# EAGLE design TC4nano_v2 (EAGLE 9.2.1)
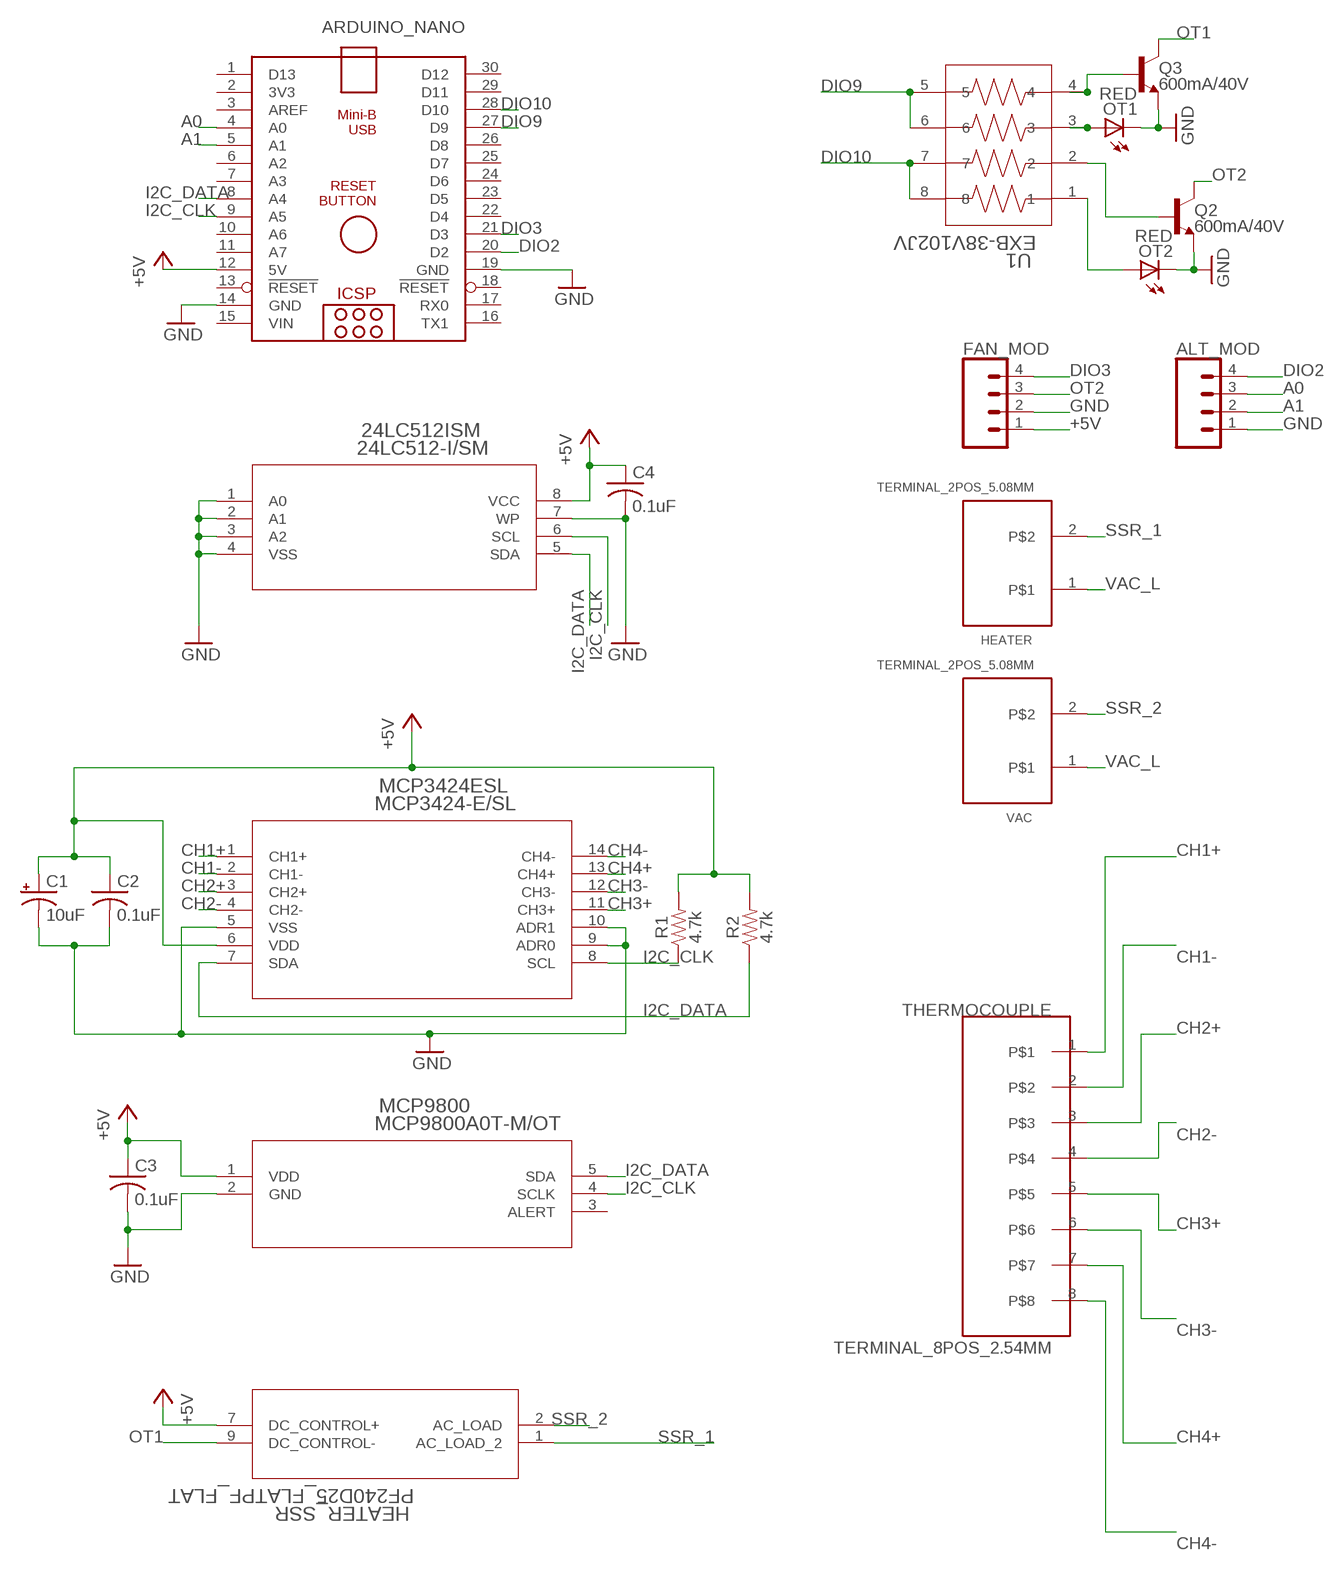
[diagram p0: schematic, sheet 1]

## Parts
24LC512ISM  24LC512-I/SM  [SOIC8-W_MC]
ALT_MOD  CONN_04LONGPADS  [1X04_LONGPADS]
ARDUINO_NANO  ARDUINO_NANO  [ARDUINO_NANO]
C1  10uF  10UF-POLAR-EIA3216-16V-10%(TANT)  [EIA3216]
C2  0.1uF  C-USC0805  [C0805]
C3  0.1uF  C-USC0805  [C0805]
C4  0.1uF  C-USC0805  [C0805]
FAN_MOD  CONN_04LONGPADS  [1X04_LONGPADS]
HEATER  TERMINAL_2POS_5.08MM  [TERMINAL_2POS_5.08MM]
HEATER_SSR  PF240D25_FLATPF_FLAT  [RELAY_PF_FLAT]
MCP3424ESL  MCP3424-E/SL  [SOIC14-N_MC]
MCP9800  MCP9800A0T-M/OT  [SOT-23-5_MC]
OT1  RED  LEDCHIPLED_0805  [CHIPLED_0805]
OT2  RED  LEDCHIPLED_0805  [CHIPLED_0805]
Q2  600mA/40V  TRANS_NPN-MMBT2222AL  [SOT23-3]
Q3  600mA/40V  TRANS_NPN-MMBT2222AL  [SOT23-3]
R1  4.7k  4.7KOHM-0603-1/10W-1%  [0603]
R2  4.7k  4.7KOHM-0603-1/10W-1%  [0603]
THERMOCOUPLE  TERMINAL_8POS_2.54MM  [TERMINAL_8POS_2.54MM]
U1  EXB-38V102JV  [C_ARRAY_EXB38V]
VAC  TERMINAL_2POS_5.08MM  [TERMINAL_2POS_5.08MM]

## Nets
+5V: 24LC512ISM.8(VCC) ARDUINO_NANO.12(5V) C1.+ C2.1 C3.1 C4.1 FAN_MOD.1 HEATER_SSR.7(DC_CONTROL+) MCP3424ESL.6(VDD) MCP9800.1(VDD) R1.2 R2.2
A0: ALT_MOD.3 ARDUINO_NANO.4(A0)
A1: ALT_MOD.2 ARDUINO_NANO.5(A1)
CH1+: MCP3424ESL.1(CH1+) THERMOCOUPLE.1
CH1-: MCP3424ESL.2(CH1-) THERMOCOUPLE.2
CH2+: MCP3424ESL.3(CH2+) THERMOCOUPLE.3
CH2-: MCP3424ESL.4(CH2-) THERMOCOUPLE.4
CH3+: MCP3424ESL.11(CH3+) THERMOCOUPLE.5
CH3-: MCP3424ESL.12(CH3-) THERMOCOUPLE.6
CH4+: MCP3424ESL.13(CH4+) THERMOCOUPLE.7
CH4-: MCP3424ESL.14(CH4-) THERMOCOUPLE.8
DIO2: ALT_MOD.4 ARDUINO_NANO.20(D2)
DIO3: ARDUINO_NANO.21(D3) FAN_MOD.4
DIO9: ARDUINO_NANO.27(D9) U1.5 U1.6
DIO10: ARDUINO_NANO.28(D10) U1.7 U1.8
GND [DC]: 24LC512ISM.1(A0) 24LC512ISM.2(A1) 24LC512ISM.3(A2) 24LC512ISM.4(VSS) 24LC512ISM.7(WP) ALT_MOD.1 ARDUINO_NANO.14(GND) ARDUINO_NANO.19(GND) C1.- C2.2 C3.2 C4.2 FAN_MOD.2 MCP3424ESL.5(VSS) MCP3424ESL.9(ADR0) MCP3424ESL.10(ADR1) MCP9800.2(GND) OT1.C OT2.C Q2.2(E) Q3.2(E)
I2C_CLK: 24LC512ISM.6(SCL) ARDUINO_NANO.9(A5) MCP3424ESL.8(SCL) MCP9800.4(SCLK) R1.1
I2C_DATA: 24LC512ISM.5(SDA) ARDUINO_NANO.8(A4) MCP3424ESL.7(SDA) MCP9800.5(SDA) R2.1
N$1: Q2.1(B) U1.2
N$4: OT2.A U1.1
N$5: Q3.1(B) U1.4
N$6: OT1.A U1.3
OT1: HEATER_SSR.9(DC_CONTROL-) Q3.3(C)
OT2: FAN_MOD.3 Q2.3(C)
SSR_1 [AC]: HEATER.2 HEATER_SSR.1(AC_LOAD_2)
SSR_2 [AC]: HEATER_SSR.2(AC_LOAD) VAC.2
VAC_L [AC]: HEATER.1 VAC.1
Unconnected: ARDUINO_NANO.1(D13) ARDUINO_NANO.2(3V3) ARDUINO_NANO.3(AREF) ARDUINO_NANO.6(A2) ARDUINO_NANO.7(A3) ARDUINO_NANO.10(A6) ARDUINO_NANO.11(A7) ARDUINO_NANO.13(!RESET) ARDUINO_NANO.16(TX1) ARDUINO_NANO.17(RX0) ARDUINO_NANO.18(!RESET) ARDUINO_NANO.22(D4) ARDUINO_NANO.23(D5) ARDUINO_NANO.24(D6) ARDUINO_NANO.25(D7) ARDUINO_NANO.26(D8) ARDUINO_NANO.29(D11) ARDUINO_NANO.30(D12) MCP9800.3(ALERT)

## Power pins joined to a net without a drawn wire
VIN: ARDUINO_NANO.15(VIN)

## Library data of the parts
24LC512ISM = DigiKey:24LC512-I/SM; MANUFACTURER_PART_NUMBER: 24LC512ISM; VENDOR: Microchip
ALT_MOD FAN_MOD = SparkFun-Connectors:CONN_04: Multi connection point. Often used as Generic Header-pin footprint for 0.1 inch spaced/style header connections On any of the 0.1 inch spaced packages, you can populate with these: Break Away Headers - Straight <https://www.sparkfun.com/products/116> (PRT-00116) Break Away Male Headers - Right Angle <https://www.sparkfun.com/products/553> (PRT-00553) Female Headers <https://www.sparkfun.com/products/115> (PRT-00115) Break Away Headers - Machine Pin <https://www.sparkfun.com/products/117> (PRT-00117) Break Away Female Headers - Swiss Machine Pin <https://www.sparkfun.com/products/743> (PRT-00743) For SCREWTERMINALS and SPRING TERMINALS visit here: Screw Terimnals on SparkFun.com <https://www.sparkfun.com/search/results?term=Screw+Terminals> (5mm/3.5mm/2.54mm spacing) This device is also useful as a general connection point to wire up your design to another part of your project. Our various solder wires solder well into these plated through hole pads. Hook-Up Wire - Assortment (Stranded, 22 AWG) <https://www.sparkfun.com/products/11375> (PRT-11375) Hook-Up Wire - Assortment (Solid Core, 22 AWG) <https://www.sparkfun.com/products/11367> (PRT-11367) View the entire wire category on our website here <https://www.sparkfun.com/categories/141> Special notes: Molex polarized connector foot print use with SKU : PRT-08231 with associated crimp pins and housings. 1MM SMD Version SKU: PRT-10208; PROD_ID: CONN-09696
ARDUINO_NANO = ArduinoNanoV30:ARDUINO_NANO: Arduino Nano V3.0 Overview: The Arduino Nano is a small, complete, and breadboard-friendly board based on the ATmega328 (Arduino Nano 3.x) or ATmega168 (Arduino Nano 2.x). It has more or less the same functionality of the Arduino Duemilanove, but in a different package. It lacks only a DC power jack, and works with a Mini-B USB cable instead of a standard one. The Nano was designed and is being produced by Gravitech. Specifications: Microcontroller Atmel ATmega168 or ATmega328 Operating Voltage (logic level) 5 V Input Voltage (recommended) 7-12 V Input Voltage (limits) 6-20 V Digital I/O Pins 14 (of which 6 provide PWM output) Analog Input Pins 8 DC Current per I/O Pin 40 mA Flash Memory 16 KB (ATmega168) or 32 KB (ATmega328) of which 2 KB used by bootloader SRAM 1 KB (ATmega168) or 2 KB (ATmega328) EEPROM 512 bytes (ATmega168) or 1 KB (ATmega328) Clock Speed 16 MHz Dimensions 0.73" x 1.70" Length 45 mm Width 18 mm Weigth 5 g Power: The Arduino Nano can be powered via the Mini-B USB connection, 6-20V unregulated external power supply (pin 30), or 5V regulated external power supply (pin 27). The power source is automatically selected to the highest voltage source. Memory: The ATmega168 has 16 KB of flash memory for storing code (of which 2 KB is used for the bootloader); the ATmega328 has 32 KB, (also with 2 KB used for the bootloader). The ATmega168 has 1 KB of SRAM and 512 bytes of EEPROM (which can be read and written with the EEPROM library); the ATmega328 has 2 KB of SRAM and 1 KB of EEPROM. Input and Output: Each of the 14 digital pins on the Nano can be used as an input or output, using pinMode(), digitalWrite(), and digitalRead() functions. They operate at 5 volts. Each pin can provide or receive a maximum of 40 mA and has an internal pull-up resistor (disconnected by default) of 20-50 kOhms. In addition, some pins have specialized functions. Visit Arduino - ArduinoBoardNano <https://www.arduino.cc/en/Main/ArduinoBoardNano>
C1 = SparkFun-Capacitors:10UF-POLAR: 10.0µF polarized capacitors A capacitor is a passive two-terminal electrical component used to store electrical energy temporarily in an electric field.; PROD_ID: CAP-00811
C2-C4 = adafruit:C-US: CAPACITOR, American symbol
HEATER VAC = TERMINAL_2POS_5.08MM:TERMINAL_2POS_5.08MM
HEATER_SSR = PF240D25x:PF240D25_FLAT
MCP3424ESL = DigiKey:MCP3424-E/SL; MANUFACTURER_PART_NUMBER: MCP3424ESL; VENDOR: Microchip
MCP9800 = DigiKey:MCP9800A0T-M/OT; MANUFACTURER_PART_NUMBER: MCP9800A0TMOT; VENDOR: Microchip
OT1 OT2 = adafruit:LED: LED OSRAM: - CHIPLED LG R971, LG N971, LY N971, LG Q971, LY Q971, LO R971, LY R971 LH N974, LH R974 LS Q976, LO Q976, LY Q976 LO Q996 - Hyper CHIPLED LW Q18S LB Q993, LB Q99A, LB R99A - SideLED LS A670, LO A670, LY A670, LG A670, LP A670 LB A673, LV A673, LT A673, LW A673 LH A674 LY A675 LS A676, LA A676, LO A676, LY A676, LW A676 LS A679, LY A679, LG A679 - Hyper Micro SIDELED® LS Y876, LA Y876, LO Y876, LY Y876 LT Y87S - SmartLED LW L88C, LW L88S LB L89C, LB L89S, LG L890 LS L89K, LO L89K, LY L89K LS L896, LA L896, LO L896, LY L896 - TOPLED LS T670, LO T670, LY T670, LG T670, LP T670 LSG T670, LSP T670, LSY T670, LOP T670, LYG T670 LG T671, LOG T671, LSG T671 LB T673, LV T673, LT T673, LW T673 LH T674 LS T676, LA T676, LO T676, LY T676, LB T676, LH T676, LSB T676, LW T676 LB T67C, LV T67C, LT T67C, LS T67K, LO T67K, LY T67K, LW E67C LS E67B, LA E67B, LO E67B, LY E67B, LB E67C, LV E67C, LT E67C LW T67C LS T679, LY T679, LG T679 LS T770, LO T770, LY T770, LG T770, LP T770 LB T773, LV T773, LT T773, LW T773 LH T774 LS E675, LA E675, LY E675, LS T675 LS T776, LA T776, LO T776, LY T776, LB T776 LHGB T686 LT T68C, LB T68C - Hyper Mini TOPLED® LB M676 - Mini TOPLED Santana® LG M470 LS M47K, LO M47K, LY M47K Source: http://www.osram.convergy.de/
Q2 Q3 = SparkFun-DiscreteSemi:TRANS_NPN: NPN transistor Current controlled devices typically used to amplify current or used as a switch. BC547 - COM-08928 <http://www.sparkfun.com/products/8928> (TO-92 45V 100mA) (1.Collector 2.Base 3.Emitter) 2N3904 - COM-00521 <http://www.sparkfun.com/products/521> (TO-92 40V 200mA) (1.Emitter 2.Base 3.Collector) P2N2222A - COM-12852 <http://www.sparkfun.com/products/12852> (TO-92 40V 600mA) (1.Collector 2.Base 3.Emitter); PROD_ID: TRANS-08049
R1 R2 = SparkFun-Resistors:4.7KOHM: 4.7kΩ resistor A resistor is a passive two-terminal electrical component that implements electrical resistance as a circuit element. Resistors act to reduce current flow, and, at the same time, act to lower voltage levels within circuits. - Wikipedia; PROD_ID: RES-07857
THERMOCOUPLE = TERMINAL_8POS_2.54MM:TERMINAL_8POS_2.54MM
U1 = R_ARRAY_1206:EXB-38V102JV; MANUFACTURER_PART_NUMBER: EXB38V102JV; VENDOR: Panasonic

## Net classes
0 default: width 0.305 mm, drill 0.127 mm, clearance 0.203 mm
1 DC: width 0.61 mm, drill 0.254 mm, clearance 0.508 mm
2 AC: width 0.813 mm, drill 0.305 mm, clearance 0.635 mm
3 Hole: drill 2.05 mm, clearance 4.8 mm

## Board
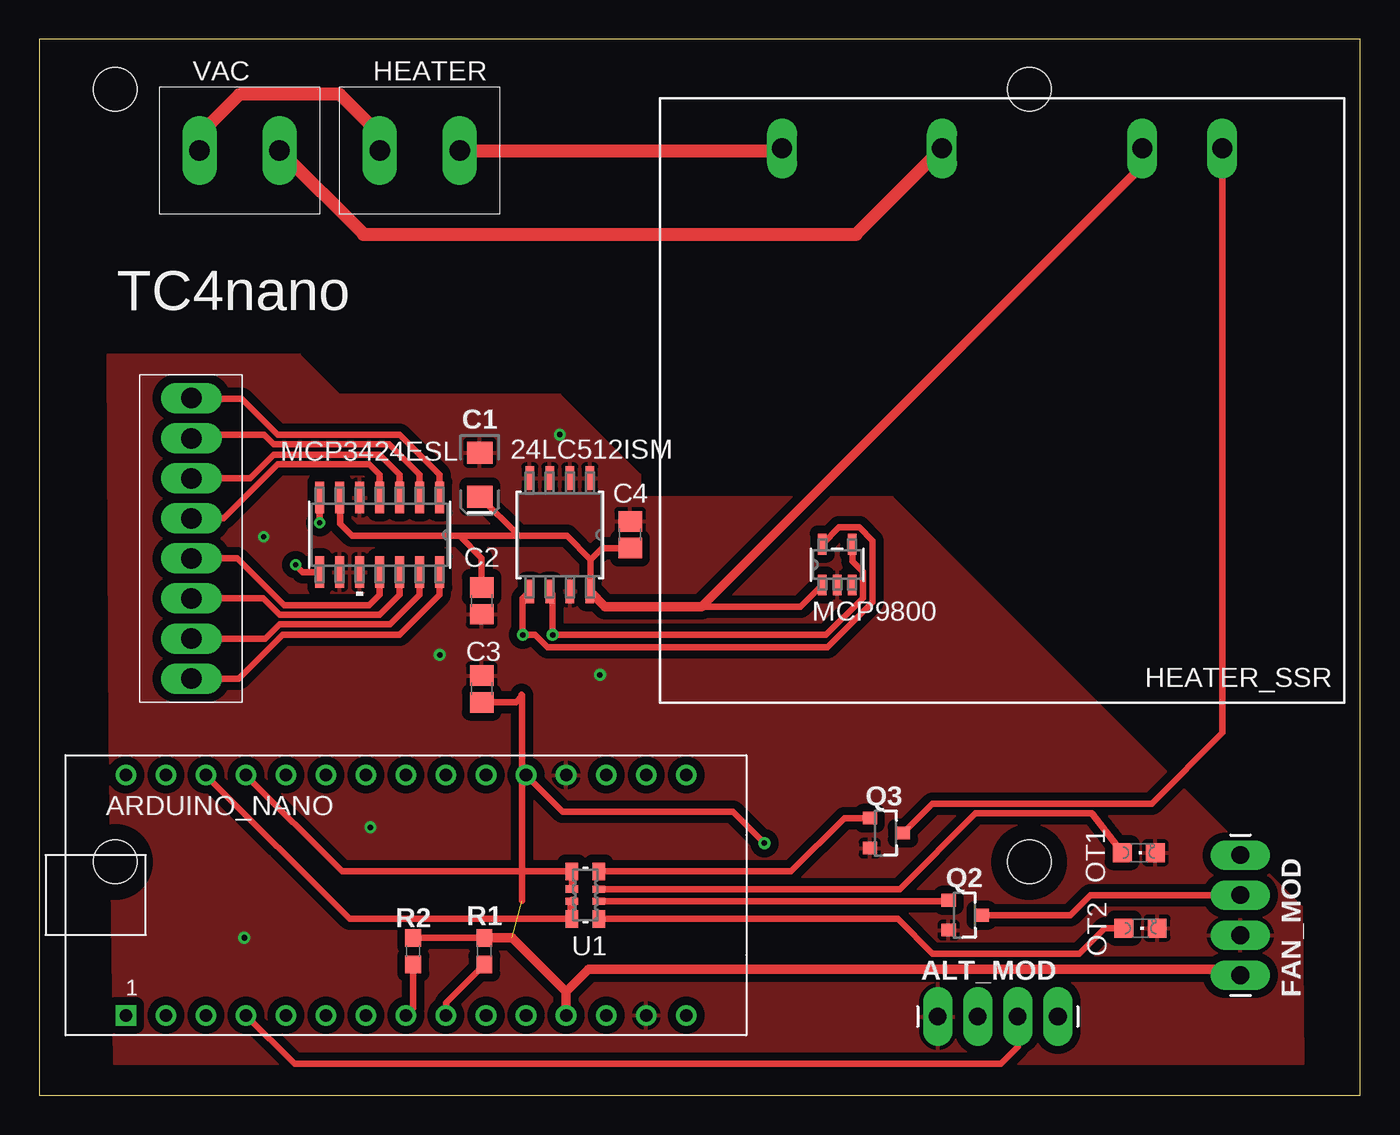
[diagram p1: board, top side]
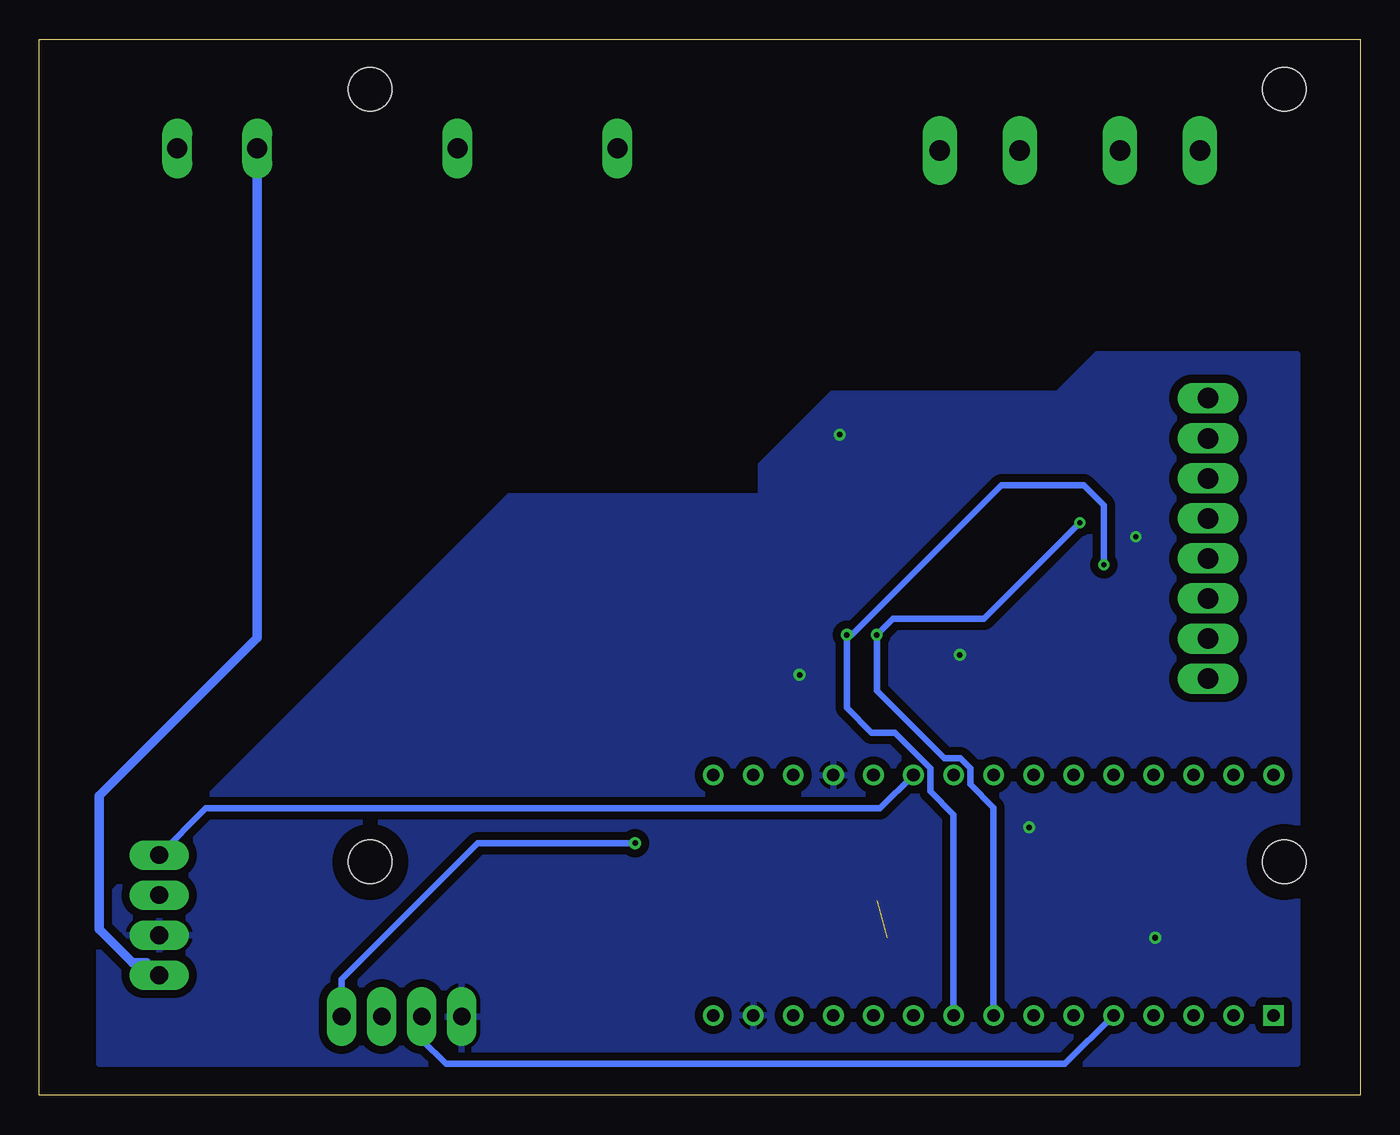
[diagram p2: board, bottom side, seen from below]

Size 83.8 x 66.98 mm. Coordinates in mm from the lower left corner, seen from the top.
Outline: 0,0 83.8,0 83.8,66.98 0,66.98 0,0
Copper layers (1*16): Top 0.035mm / dielectric 1.5mm / Bottom 0.035mm
Design rules "default": minimum track width 6mil, minimum drill 0.35mm, track to track 6mil, track to pad 6mil, pad to pad 6mil, via to via 6mil, smd to smd 6mil, copper to edge 40mil, drill to drill 6mil, minimum pad ring 10mil, minimum via ring 8mil, stop-mask expansion 4mil, vias tented up to drill 0mil, thermal gap 10mil
Holes 2.75 mm at 4.81,14.81 4.81,63.81 62.81,14.81 62.81,63.81

### Footprints (pad centres in the part's own frame; a part is rotated, then mirrored left to right if it is on the bottom)
SOIC8-W_MC = smd 1.473 x 0.559: 1 -3.594,1.905; 2 -3.594,0.635; 3 -3.594,-0.635; 4 -3.594,-1.905; 5 3.594,-1.905; 6 3.594,-0.635; 7 3.594,0.635; 8 3.594,1.905
1X04_LONGPADS = drill 1.118 pad 1.88 long: 1 0,0; 2 2.54,0; 3 5.08,0; 4 7.62,0
ARDUINO_NANO = drill 0.8 square: 1 -20.32,-7.62 | drill 0.8: 2 -17.78,-7.62; 3 -15.24,-7.62; 4 -12.7,-7.62; 5 -10.16,-7.62; 6 -7.62,-7.62; 7 -5.08,-7.62; 8 -2.54,-7.62; 9 0,-7.62; 10 2.54,-7.62; 11 5.08,-7.62; 12 7.62,-7.62; 13 10.16,-7.62; 14 12.7,-7.62; 15 15.24,-7.62; 16 15.24,7.62; 17 12.7,7.62; 18 10.16,7.62; 19 7.62,7.62; 20 5.08,7.62; 21 2.54,7.62; 22 0,7.62; 23 -2.54,7.62; 24 -5.08,7.62; 25 -7.62,7.62; 26 -10.16,7.62; 27 -12.7,7.62; 28 -15.24,7.62; 29 -17.78,7.62; 30 -20.32,7.62
EIA3216 = smd 1.4 x 1.6: + 1.4,0; - -1.4,0
C0805 = smd 1.3 x 1.5: 1 -0.85,0; 2 0.85,0
TERMINAL_2POS_5.08MM = drill 1.3 pad 2.184 long: 1 2.54,4.05; 2 7.62,4.05
RELAY_PF_FLAT = drill 1.27 long: 1 7.874,-3.175; 2 18.034,-3.175; 7 30.734,-3.175; 9 35.814,-3.175
SOIC14-N_MC = smd 1.981 x 0.559: 1 -2.362,3.81; 2 -2.362,2.54; 3 -2.362,1.27; 4 -2.362,0; 5 -2.362,-1.27; 6 -2.362,-2.54; 7 -2.362,-3.81; 8 2.362,-3.81; 9 2.362,-2.54; 10 2.362,-1.27; 11 2.362,0; 12 2.362,1.27; 13 2.362,2.54; 14 2.362,3.81
SOT-23-5_MC = smd 1.321 x 0.559: 1 -1.295,0.95; 2 -1.295,0; 3 -1.295,-0.95; 4 1.295,-0.95; 5 1.295,0.95
CHIPLED_0805 = smd 1.2 x 1.2: A 0,-1.05; C 0,1.05
SOT23-3 = smd 0.8 x 0.9: 1 -0.95,-1; 2 0.95,-1; 3 0,1.1
0603 = smd 1.1 x 1: 1 -0.85,0; 2 0.85,0
TERMINAL_8POS_2.54MM = drill 1.3 pad 1.93 long: 1 1.5,3.3; 2 4.04,3.3; 3 6.58,3.3; 4 9.12,3.3; 5 11.66,3.3; 6 14.2,3.3; 7 16.74,3.3; 8 19.28,3.3
C_ARRAY_EXB38V = smd 0.807 x 1.107: 1 -0.854,1.504; 4 -0.854,-1.504; 5 0.854,-1.504; 8 0.854,1.504 | smd 0.807 x 0.45: 2 -0.854,0.395; 3 -0.854,-0.385; 6 0.854,-0.395; 7 0.854,0.385

### Placement (x,y rotation side)
24LC512ISM  33.02,35.56 270 top
ALT_MOD  57,5 0 top
ARDUINO_NANO  25.8,12.7 0 top
C1  27.94,39.37 270 top
C2  28.07,31.37 270 top
C3  28.07,25.78 90 top
C4  37.48,35.56 90 top
FAN_MOD  76.2,7.62 90 top
HEATER  19.05,55.88 0 top
HEATER_SSR  39.24,63.25 0 top
MCP3424ESL  21.59,35.56 270 top
MCP9800  50.62,33.67 90 top
OT1  69.76,15.39 270 top
OT2  69.87,10.61 270 top
Q2  58.69,11.43 270 top
Q3  53.69,16.64 270 top
R1  28.23,9.14 90 top
R2  23.72,9.14 90 top
THERMOCOUPLE  6.35,45.72 270 top
U1  34.64,12.7 180 top
VAC  7.62,55.88 0 top

### Tracks (layer width: path | path; a pad name or v marks a point on that pad's centre or on a via)
+5V  (1 unrouted)
  Top 0.406: MCP3424ESL.6 19.07,37.64 19.07,36.26 19.85,35.48 26.67,35.48 | 26.67,35.48 30.43,35.48 | C1.+ 30.43,35.48 | C2.1 28.07,34.09 26.67,35.48 | 30.61,25.4 30.63,25.38 30.63,25.33 | 30.43,35.48 33.48,35.48 34.98,33.98 | 28.51,9.99 R1.2 R2.2 | C3.1 30.23,24.93 30.63,25.33 | 30.63,12.33 30.63,25.33 | 40.79,31 41,31 | 24LC512ISM.8 34.98,32.02 34.98,33.98 | 34.98,33.98 35.71,34.71 C4.1 | MCP9800.1 48.3,31 42,31
  Top 0.61: 69.98,58.67 HEATER_SSR.7 69.98,58.98 42,31 41,31 35.89,31 24LC512ISM.8 | FAN_MOD.1 75.82,8 34.84,8 33.42,6.58 | ARDUINO_NANO.12 33.42,6.58 | R1.2 30.01,9.99 33.42,6.58
  Bottom 0.61: FAN_MOD.1 76.99,8.41 77.87,8.41 80,10.54 80,19 69.98,29.02 HEATER_SSR.7
A0
  Top 0.406: ARDUINO_NANO.4 16.18,2 61,2 62.08,3.08 ALT_MOD.3
A1
  Bottom 0.406: ARDUINO_NANO.5 18.72,2 58,2 59.54,3.54 ALT_MOD.2
CH1+
  Top 0.406: MCP3424ESL.1 25.4,39.37 22.86,41.91 15.11,41.91 12.83,44.2 9.67,44.2 THERMOCOUPLE.1
CH1-
  Top 0.406: THERMOCOUPLE.2 9.88,41.91 14.25,41.91 14.86,41.3 22.2,41.3 24.13,39.37 MCP3424ESL.2
CH2+
  Top 0.406: MCP3424ESL.3 22.86,39.37 21.59,40.64 14.86,40.64 13.36,39.14 THERMOCOUPLE.3
CH2-
  Top 0.406: MCP3424ESL.4 21.59,39.37 20.93,40.03 15.11,40.03 11.68,36.6 THERMOCOUPLE.4
CH3+
  Top 0.406: THERMOCOUPLE.5 12.55,34.06 15.52,31.09 20.93,31.09 21.59,31.75 MCP3424ESL.11
CH3-
  Top 0.406: THERMOCOUPLE.6 14.2,31.52 15.24,30.48 21.59,30.48 22.86,31.75 MCP3424ESL.12
CH4+
  Top 0.406: MCP3424ESL.13 24.13,31.75 22.25,29.87 15.24,29.87 14.33,28.96 9.67,28.96 THERMOCOUPLE.7
CH4-
  Top 0.406: MCP3424ESL.14 25.4,31.75 22.86,29.21 15.44,29.21 12.65,26.42 9.67,26.42 THERMOCOUPLE.8
DIO2  (via drill 0.35)
  Top 0.406: ARDUINO_NANO.20 33.2,18 44,18 v46,16
  Bottom 0.406: ALT_MOD.4 64.62,7.38 56,16 v46,16
DIO3
  Bottom 0.406: FAN_MOD.4 73.24,18.2 30.46,18.2 ARDUINO_NANO.21
DIO9
  Top 0.406: U1.6 U1.5 19.22,14.2 ARDUINO_NANO.27
DIO10
  Top 0.406: U1.8 19.68,11.2 ARDUINO_NANO.28
  Top 0.61: U1.8 U1.7
GND  (via drill 0.3, 0.35)
  other vias: 14.22,35.43 35.56,26.67 25.4,27.94 33.02,41.91 21,17 13,10
  pour Top: 4.35,46.99 4.45,22.49 4.74,2 80.21,2 80.09,11.97 54.12,37.94 38.1,37.94 38.1,39.37 33.02,44.45 19.05,44.45 16.51,46.99
  pour Bottom: 4,47 4,2 80,2 80,12 54,38 38,38 38,40 33.5,44.5 19.2,44.5 16.7,47
I2C_CLK  (via drill 0.3, 0.35)
  Top 0.406: v16.26,33.66 16.71,33.2 MCP3424ESL.8 | 24LC512ISM.6 32.57,31.78 v32.57,29.21 49.92,29.21 52.26,31.55 52.26,33.2 51.57,33.89 MCP9800.4 | R1.1 25.8,5.87 ARDUINO_NANO.9
  Bottom 0.406: v16.26,33.66 16.26,37.44 17.53,38.71 22.76,38.71 32.26,29.21 v32.57,29.21 32.57,24.57 31,23 29.52,23 27.28,20.76 27.28,19.28 25.8,17.8 ARDUINO_NANO.9
I2C_DATA  (via drill 0.3, 0.35)
  Top 0.406: 31.08,31.97 24LC512ISM.5 30.67,31.52 v30.67,29.21 31.46,29.21 32.25,28.43 50,28.43 52.87,31.29 52.87,35.19 52.02,36.03 50.74,36.03 MCP9800.5 | MCP3424ESL.7 v17.78,36.32 | R2.1 23.72,5.54 ARDUINO_NANO.8
  Bottom 0.406: v17.78,36.32 23.88,30.23 29.66,30.23 v30.67,29.21 30.67,25.67 26.38,21.38 25.36,21.38 24.74,20.76 24.74,19.74 23.26,18.26 ARDUINO_NANO.8
N$1
  Top 0.406: U1.2 57.62,12.3 Q2.1
N$4
  Top 0.406: U1.1 54.48,11.2 56.68,9 66,9 67.61,10.61 OT2.A
N$5
  Top 0.406: U1.4 47.7,14.2 51.09,17.59 Q3.1
N$6
  Top 0.406: U1.3 44.84,13.09 54.59,13.09 59.39,17.89 66.79,17.89 OT1.A
OT1
  Top 0.406: Q3.3 56.65,18.5 70.57,18.5 75.06,22.99 HEATER_SSR.9
OT2
  Top 0.406: Q2.3 65.43,11.43 66.7,12.7 FAN_MOD.3
SSR_1
  Top 0.813: HEATER.2 46.98,59.93 HEATER_SSR.1
SSR_2
  Top 0.813: VAC.2 20.56,54.61 51.82,54.61 HEATER_SSR.2
VAC_L
  Top 0.813: HEATER.1 21.59,60.96 19.05,63.5 12.7,63.5 10.16,60.96 VAC.1

### Text on the board
tNames: TC4nano